# EAGLE design Natsuky (EAGLE 7.2.0)
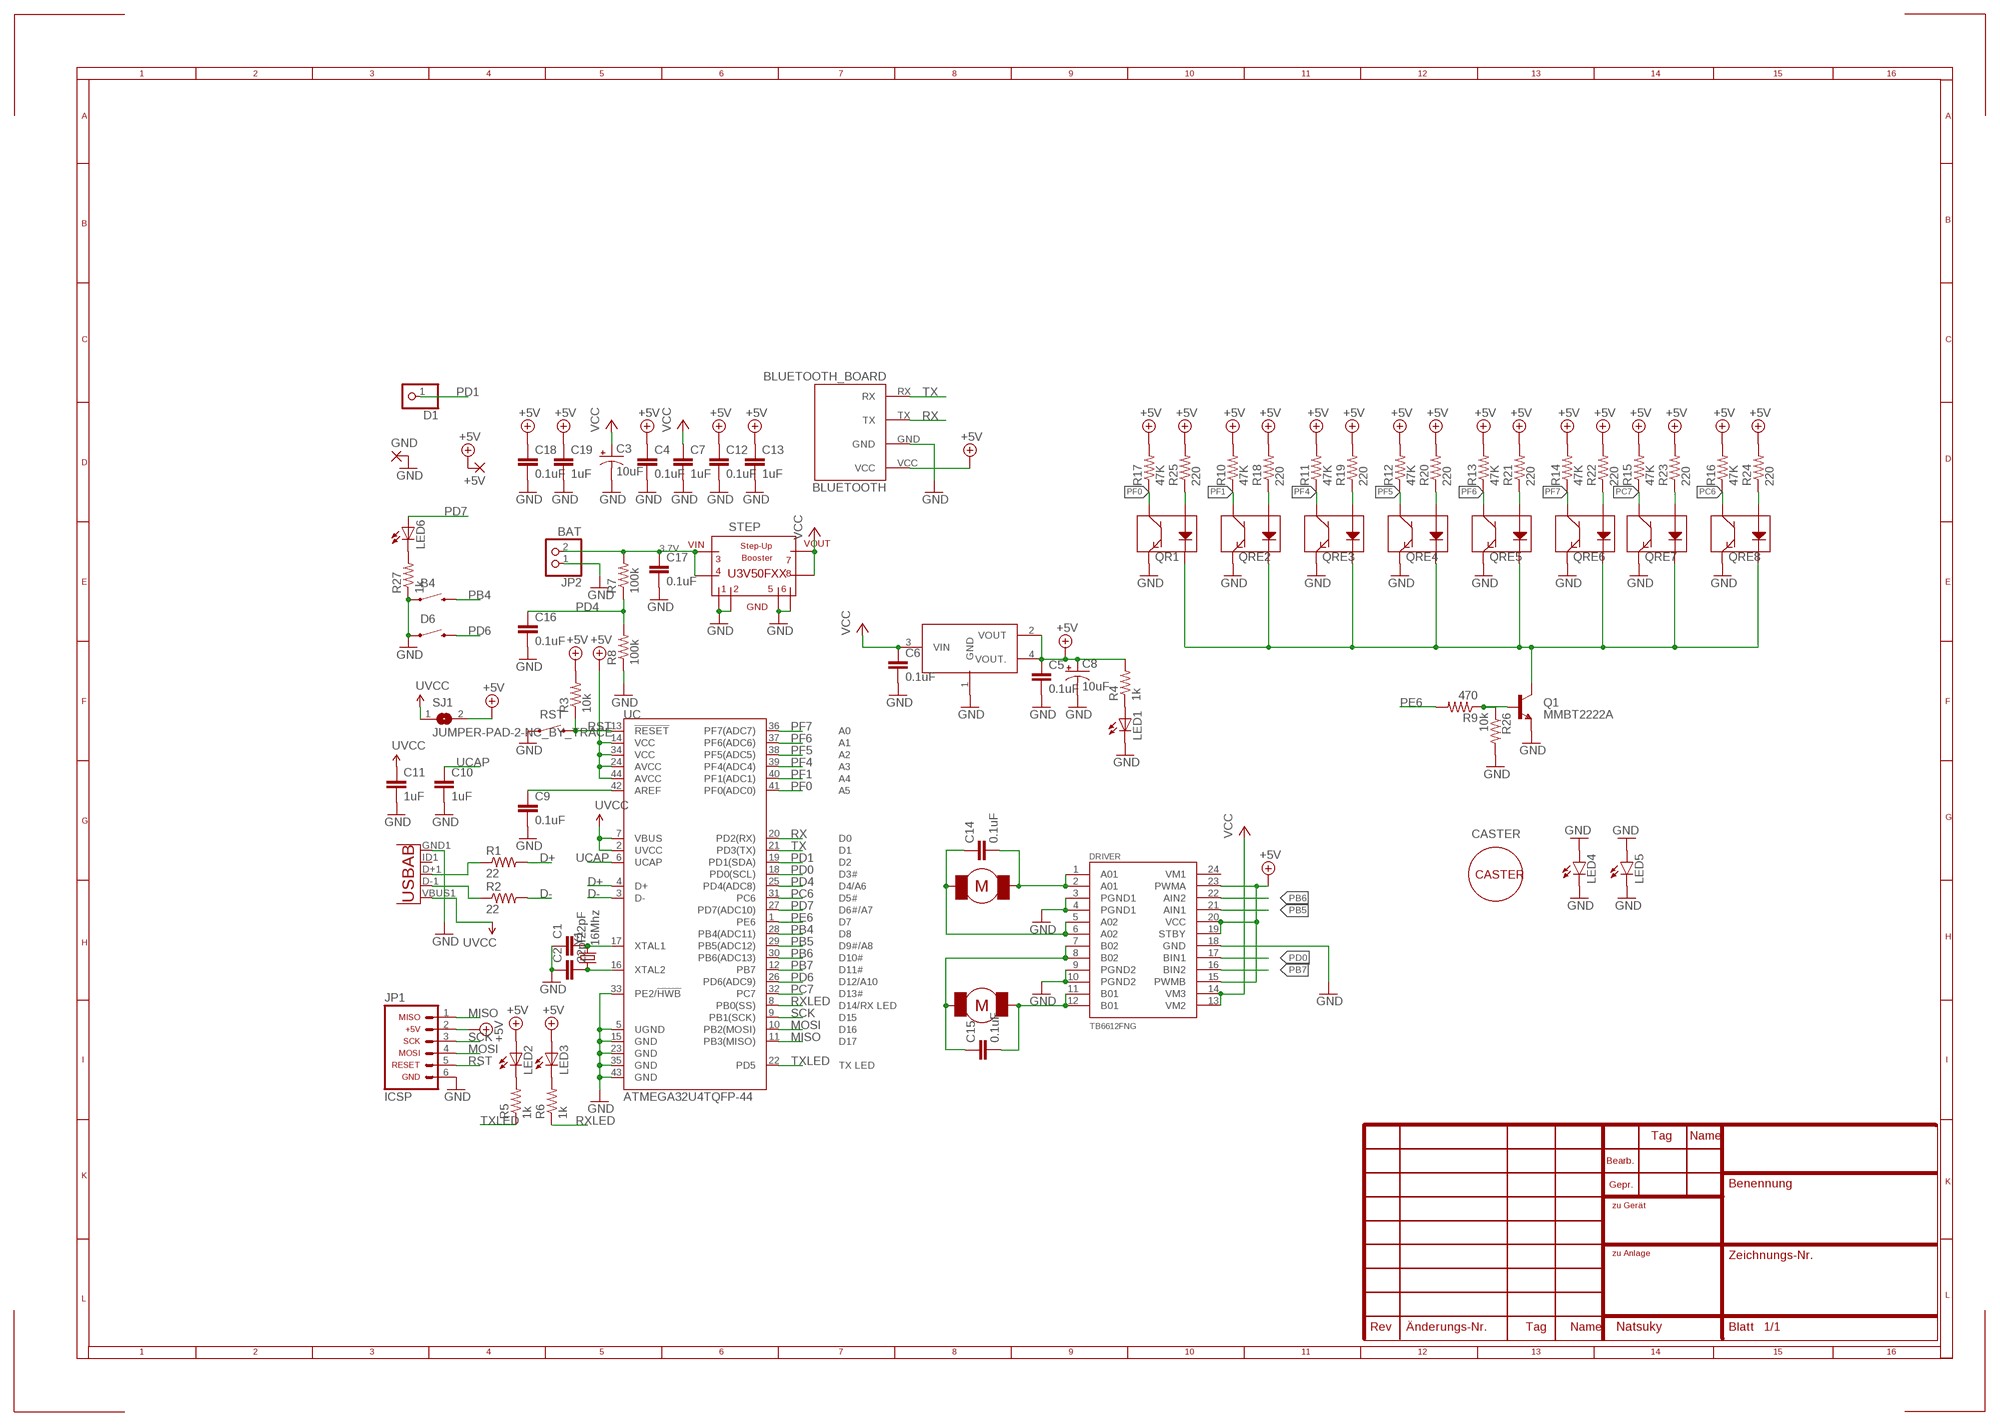
[diagram p0: schematic, sheet 1]

## Parts
+5V  SMD2  [SMD1,27-2,54]
B4  SWITCH-MOMENTARY-2SMD-1101NE  [TACTILE-SWITCH-1101NE]
BLUETOOTH  BLUETOOTH_BOARD  [BT_BOARD_FOOTPRINT]
C1  22pF  CAP0805  [0805]
C2  22pF  CAP0805  [0805]
C3  10uF  CAP_POL1206  [EIA3216]
C4  0.1uF  CAP0805  [0805]
C5  0.1uF  CAP0805  [0805]
C6  0.1uF  CAP0805  [0805]
C7  1uF  CAP0805  [0805]
C8  10uF  CAP_POLD  [PANASONIC_D]
C9  0.1uF  CAP0805  [0805]
C10  1uF  CAP0805  [0805]
C11  1uF  CAP0805  [0805]
C12  0.1uF  CAP0805  [0805]
C13  1uF  CAP0805  [0805]
C14  0.1uF  CAP0805  [0805]
C15  0.1uF  CAP0805  [0805]
C16  0.1uF  CAP0805  [0805]
C17  0.1uF  CAP0805  [0805]
C18  0.1uF  CAP0805  [0805]
C19  1uF  CAP0805  [0805]
CASTER  BALL_CASTER  [BALL_CASTER]
D1  PINHD-1X1  [1X01]
D6  SWITCH-MOMENTARY-2SMD-1101NE  [TACTILE-SWITCH-1101NE]
DRIVER  TB6612FNG  [SSOP24]
GND  SMD2  [SMD1,27-2,54]
JP1  ICSP  ARDUINO_CONN-ICSP  [CONN-2X03]
JP2  BAT  PINHD-1X2  [1X02]
LED1  LEDCHIPLED_1206  [CHIPLED_1206]
LED2  LEDCHIPLED_1206  [CHIPLED_1206]
LED3  LEDCHIPLED_1206  [CHIPLED_1206]
LED4  LED5MM  [LED5MM]
LED5  LED5MM  [LED5MM]
LED6  LEDCHIPLED_1206  [CHIPLED_1206]
M1  BRACKET_EXTENDED_WHITE  [WHITE_EXT]
M2  BRACKET_EXTENDED_WHITE  [WHITE_EXT]
Q1  MMBT2222A  TRANSISTOR_NPNMMBT2222A  [SOT23-3]
QR1  QRE1113SMD-W  [QRE1113-W]
QRE2  QRE1113SMD-W  [QRE1113-W]
QRE3  QRE1113SMD-W  [QRE1113-W]
QRE4  QRE1113SMD-W  [QRE1113-W]
QRE5  QRE1113SMD-W  [QRE1113-W]
QRE6  QRE1113SMD-W  [QRE1113-W]
QRE7  QRE1113SMD-W  [QRE1113-W]
QRE8  QRE1113SMD-W  [QRE1113-W]
R1  22  RESISTOR0805-RES  [0805]
R2  22  RESISTOR0805-RES  [0805]
R3  10k  RESISTOR0805-RES  [0805]
R4  1k  RESISTOR0805-RES  [0805]
R5  1k  RESISTOR0805-RES  [0805]
R6  1k  RESISTOR0805-RES  [0805]
R7  100k  RESISTOR0805-RES  [0805]
R8  100k  RESISTOR0805-RES  [0805]
R9  470  RESISTOR0805-RES  [0805]
R10  47K  RESISTOR0805-RES  [0805]
R11  47K  RESISTOR0805-RES  [0805]
R12  47K  RESISTOR0805-RES  [0805]
R13  47K  RESISTOR0805-RES  [0805]
R14  47K  RESISTOR0805-RES  [0805]
R15  47K  RESISTOR0805-RES  [0805]
R16  47K  RESISTOR0805-RES  [0805]
R17  47K  RESISTOR0805-RES  [0805]
R18  220  RESISTOR0805-RES  [0805]
R19  220  RESISTOR0805-RES  [0805]
R20  220  RESISTOR0805-RES  [0805]
R21  220  RESISTOR0805-RES  [0805]
R22  220  RESISTOR0805-RES  [0805]
R23  220  RESISTOR0805-RES  [0805]
R24  220  RESISTOR0805-RES  [0805]
R25  220  RESISTOR0805-RES  [0805]
R26  10k  RESISTOR0805-RES  [0805]
R27  1k  RESISTOR0805-RES  [0805]
REG  LD1117S50TR  [SOT223]
RST  SWITCH-MOMENTARY-2SMD-1101NE  [TACTILE-SWITCH-1101NE]
SJ1  JUMPER-PAD-2-NC_BY_TRACE  SJ  [SJ]
STEP  STEP-UP  [U3V50F12]
UC  ATMEGA32U4TQFP-44  [TQFP44]
X1  usb  USB-ABIN&OUT  [USB-AB-MICRO-SMD-V03-IN&OUT]
Y1  16Mhz  CRYSTALHC49US  [HC49US]

## Nets
3.3V: C11.1 SJ1.1 UC.2(UVCC) UC.7(VBUS) X1.VBUS1(VBUS) ; supply symbol labelled UVCC
3.7V: C17.1 JP2.2 R7.2 STEP.VIN STEP.VIN_4(VIN4)
+5V: +5V.1(P) BLUETOOTH.VCC C4.1 C5.1 C8.+ C12.1 C13.1 C18.1 C19.1 DRIVER.15(PWMB) DRIVER.19(STBY) DRIVER.20(VCC) DRIVER.23(PWMA) JP1.2 LED2.A LED3.A R3.2 R4.2 R10.2 R11.2 R12.2 R13.2 R14.2 R15.2 R16.2 R17.2 R18.2 R19.2 R20.2 R21.2 R22.2 R23.2 R24.2 R25.2 REG.2(VOUT) REG.4(VOUT.) SJ1.2 UC.14(VCC) UC.24(AVCC) UC.34(VCC) UC.44(AVCC)
COLECTOR_EMISORES: Q1.3(C) QR1.2(K) QRE2.2(K) QRE3.2(K) QRE4.2(K) QRE5.2(K) QRE6.2(K) QRE7.2(K) QRE8.2(K)
D+: R1.2 UC.4(D+)
D-: R2.2 UC.3(D-)
GND: B4.1 BLUETOOTH.GND C1.1 C2.1 C3.C(-) C4.2 C5.2 C6.2 C7.2 C8.- C9.2 C10.2 C11.2 C12.2 C13.2 C16.2 C17.2 C18.2 C19.2 D6.1 DRIVER.3(PGND1) DRIVER.4(PGND1) DRIVER.9(PGND2) DRIVER.10(PGND2) DRIVER.18(GND) GND.1(P) JP1.6 JP2.1 LED1.C LED4.A LED4.K(C) LED5.A LED5.K(C) Q1.2(E) QR1.4(E) QRE2.4(E) QRE3.4(E) QRE4.4(E) QRE5.4(E) QRE6.4(E) QRE7.4(E) QRE8.4(E) R8.1 R26.2 R27.1 REG.1(GND) RST.1 STEP.GND_OUT(GND_VOUT) STEP.GND_OUT_1(GND_OUT1) STEP.GND_VIN STEP.GND_VIN_1(GND_VIN1) UC.5(UGND) UC.15(GND) UC.23(GND) UC.33(PE2/!HWB) UC.35(GND) UC.43(GND) X1.GND1(GND)
M1: C14.2 DRIVER.1(A01) DRIVER.2(A01) M2.M1
M2: C14.1 DRIVER.5(A02) DRIVER.6(A02) M2.M2
M3: C15.1 DRIVER.7(B02) DRIVER.8(B02) M1.M1
M4: C15.2 DRIVER.11(B01) DRIVER.12(B01) M1.M2
MISO: JP1.1 UC.11(PB3(MISO))
MOSI: JP1.4 UC.10(PB2(MOSI))
N$1: C1.2 UC.17(XTAL1) Y1.2
N$2: C2.2 UC.16(XTAL2) Y1.1
N$3: Q1.1(B) R9.1 R26.1
N$4: LED1.A R4.1
N$5: LED2.C R5.2
N$6: LED3.C R6.2
N$7: R2.1 X1.D-1(D-)
N$8: R1.1 X1.D+1(D+)
N$9: C9.1 UC.42(AREF)
N$10: LED6.C R27.2
N$17: QRE2.1(A) R18.1
N$18: QRE3.1(A) R19.1
N$19: QRE4.1(A) R20.1
N$20: QRE5.1(A) R21.1
N$21: QRE6.1(A) R22.1
N$22: QRE7.1(A) R23.1
N$23: QRE8.1(A) R24.1
N$24: QR1.1(A) R25.1
PB4: B4.2 UC.28(PB4(ADC11))
PB5: DRIVER.21(AIN1) UC.29(PB5(ADC12))
PB6: DRIVER.22(AIN2) UC.30(PB6(ADC13))
PB7: DRIVER.16(BIN2) UC.12(PB7)
PC6: QRE8.3(C) R16.1 UC.31(PC6)
PC7: QRE7.3(C) R15.1 UC.32(PC7)
PD0: DRIVER.17(BIN1) UC.18(PD0(SCL))
PD1: D1.1 UC.19(PD1(SDA))
PD4: C16.1 R7.1 R8.2 UC.25(PD4(ADC8))
PD6: D6.2 UC.26(PD6(ADC9))
PD7: LED6.A UC.27(PD7(ADC10))
PE6: R9.2 UC.1(PE6)
PF0: QR1.3(C) R17.1 UC.41(PF0(ADC0))
PF1: QRE2.3(C) R10.1 UC.40(PF1(ADC1))
PF4: QRE3.3(C) R11.1 UC.39(PF4(ADC4))
PF5: QRE4.3(C) R12.1 UC.38(PF5(ADC5))
PF6: QRE5.3(C) R13.1 UC.37(PF6(ADC6))
PF7: QRE6.3(C) R14.1 UC.36(PF7(ADC7))
RST: JP1.5 R3.1 RST.2 UC.13(!RESET)
RX: BLUETOOTH.TX UC.20(PD2(RX))
RXLED: R6.1 UC.8(PB0(SS))
SCK: JP1.3 UC.9(PB1(SCK))
TX: BLUETOOTH.RX UC.21(PD3(TX))
TXLED: R5.1 UC.22(PD5)
UCAP: C10.1 UC.6(UCAP)
VCC: C3.A(+) C6.1 C7.1 DRIVER.13(VM2) DRIVER.14(VM3) REG.3(VIN) STEP.VOUT STEP.VOUT_4(VOUT4)
Unconnected: DRIVER.24(VM1) X1.ID1(USBID)

## Library data of the parts
+5V GND = wirepad:SMD2: SMD PAD
B4 D6 RST = SparkFun-Electromechanical:SWITCH-MOMENTARY-2: Various NO switches- pushbuttons, reed, etc; PROD_ID: SWCH-00815
BLUETOOTH = HC-05:BLUETOOTH_BOARD: Bluetooth Board V1.05
C1 C2 = SparkFun-Capacitors:CAP: Capacitor Standard 0603 ceramic capacitor, and 0.1" leaded capacitor.
C3 C8 = SparkFun-Passives:CAP_POL: Capacitor Polarized These are standard SMD and PTH capacitors. Normally 10uF, 47uF, and 100uF in electrolytic and tantalum varieties. Always verify the external diameter of the through hole cap, it varies with capacity, voltage, and manufacturer. The EIA devices should be standard.
C4-C7 C9-C19 = SparkFun-Passives:CAP: Capacitor Standard 0603 ceramic capacitor, and 0.1" leaded capacitor.
CASTER = bracket_motor:BALL_CASTER
D1 = pinhead:PINHD-1X1: PIN HEADER
DRIVER = SparkFun-PowerIC:TB6612FNG: Toshiba 1A dual motor driver IC-09363; PROD_ID: IC-09363
JP1 = arduino_jw:ARDUINO_CONN-ICSP: Arduino ICSP I/O Header This is the ICSP I/O header on the Arduino Uno R3. This connector is labeled with the following pin assignments: MISO +5V SCK MOSI RESET GND NOTE: Be sure you install this connector with the correct orientation on your PCB layout. Pin 1 has a square pad to assist with orientation.
JP2 = pinhead:PINHD-1X2: PIN HEADER
LED1-LED3 LED6 = adafruit:LED: LED OSRAM: - CHIPLED LG R971, LG N971, LY N971, LG Q971, LY Q971, LO R971, LY R971 LH N974, LH R974 LS Q976, LO Q976, LY Q976 LO Q996 - Hyper CHIPLED LW Q18S LB Q993, LB Q99A, LB R99A - SideLED LS A670, LO A670, LY A670, LG A670, LP A670 LB A673, LV A673, LT A673, LW A673 LH A674 LY A675 LS A676, LA A676, LO A676, LY A676, LW A676 LS A679, LY A679, LG A679 - Hyper Micro SIDELED® LS Y876, LA Y876, LO Y876, LY Y876 LT Y87S - SmartLED LW L88C, LW L88S LB L89C, LB L89S, LG L890 LS L89K, LO L89K, LY L89K LS L896, LA L896, LO L896, LY L896 - TOPLED LS T670, LO T670, LY T670, LG T670, LP T670 LSG T670, LSP T670, LSY T670, LOP T670, LYG T670 LG T671, LOG T671, LSG T671 LB T673, LV T673, LT T673, LW T673 LH T674 LS T676, LA T676, LO T676, LY T676, LB T676, LH T676, LSB T676, LW T676 LB T67C, LV T67C, LT T67C, LS T67K, LO T67K, LY T67K, LW E67C LS E67B, LA E67B, LO E67B, LY E67B, LB E67C, LV E67C, LT E67C LW T67C LS T679, LY T679, LG T679 LS T770, LO T770, LY T770, LG T770, LP T770 LB T773, LV T773, LT T773, LW T773 LH T774 LS E675, LA E675, LY E675, LS T675 LS T776, LA T776, LO T776, LY T776, LB T776 LHGB T686 LT T68C, LB T68C - Hyper Mini TOPLED® LB M676 - Mini TOPLED Santana® LG M470 LS M47K, LO M47K, LY M47K Source: http://www.osram.convergy.de/
LED4 LED5 = SparkFun-LED:LED: LEDs Standard schematic elements and footprints for 5mm, 3mm, 1206, and 0603 sized LEDs. 5mm - Spark Fun Electronics SKU : COM-00529 (and others)
M1 M2 = bracket_motor:BRACKET_EXTENDED_WHITE
Q1 = SparkFun-DiscreteSemi:TRANSISTOR_NPN: Generic NPN BJT MMBT2222A - TRANS-08049 (SOT-23, 1A 40V) MPSA42 - TRANS-09116 (SOT-23, 500mA 300V) MMBT5088LT1G - TRANS-11160 (SOT-23, 50 mA 30V) BC547 - COM-08928 <http://www.sparkfun.com/products/8928> (TO-92 45V 100mA) (1.Collector 2.Base 3.Emitter) 2N3904 - COM-00521 <http://www.sparkfun.com/products/521> (TO-92 40V 200mA) (1.Emitter 2.Base 3.Collector) P2N2222A - COM-12852 <http://www.sparkfun.com/products/12852> (TO-92 40V 600mA) (1.Collector 2.Base 3.Emitter); PROD_ID: TRANS-08049
QR1 QRE2-QRE8 = SparkFun-Sensors:QRE1113: Reflective object sensor
R1-R27 = SparkFun-Resistors:RESISTOR: Resistor Basic schematic elements and footprints for 0603, 1206, and PTH resistors.
REG = v-reg:LD1117S50TR
SJ1 = jumper:SJ: SMD solder JUMPER
STEP = step-up-Pololu:STEP-UP
UC = SparkFun-DigitalIC:ATMEGA32U4: Atmel 44-pin 8-bit Microcontroller with 32KBytes of ISP Flash and USB Controller
X1 = Testing:USB-AB: This is a USB AB connector that is compatible with USB OTG. i.e. this connector can serve as a host or device
Y1 = SparkFun-FreqCtrl:CRYSTAL: Various standard crystals. Proven footprints.

## Board
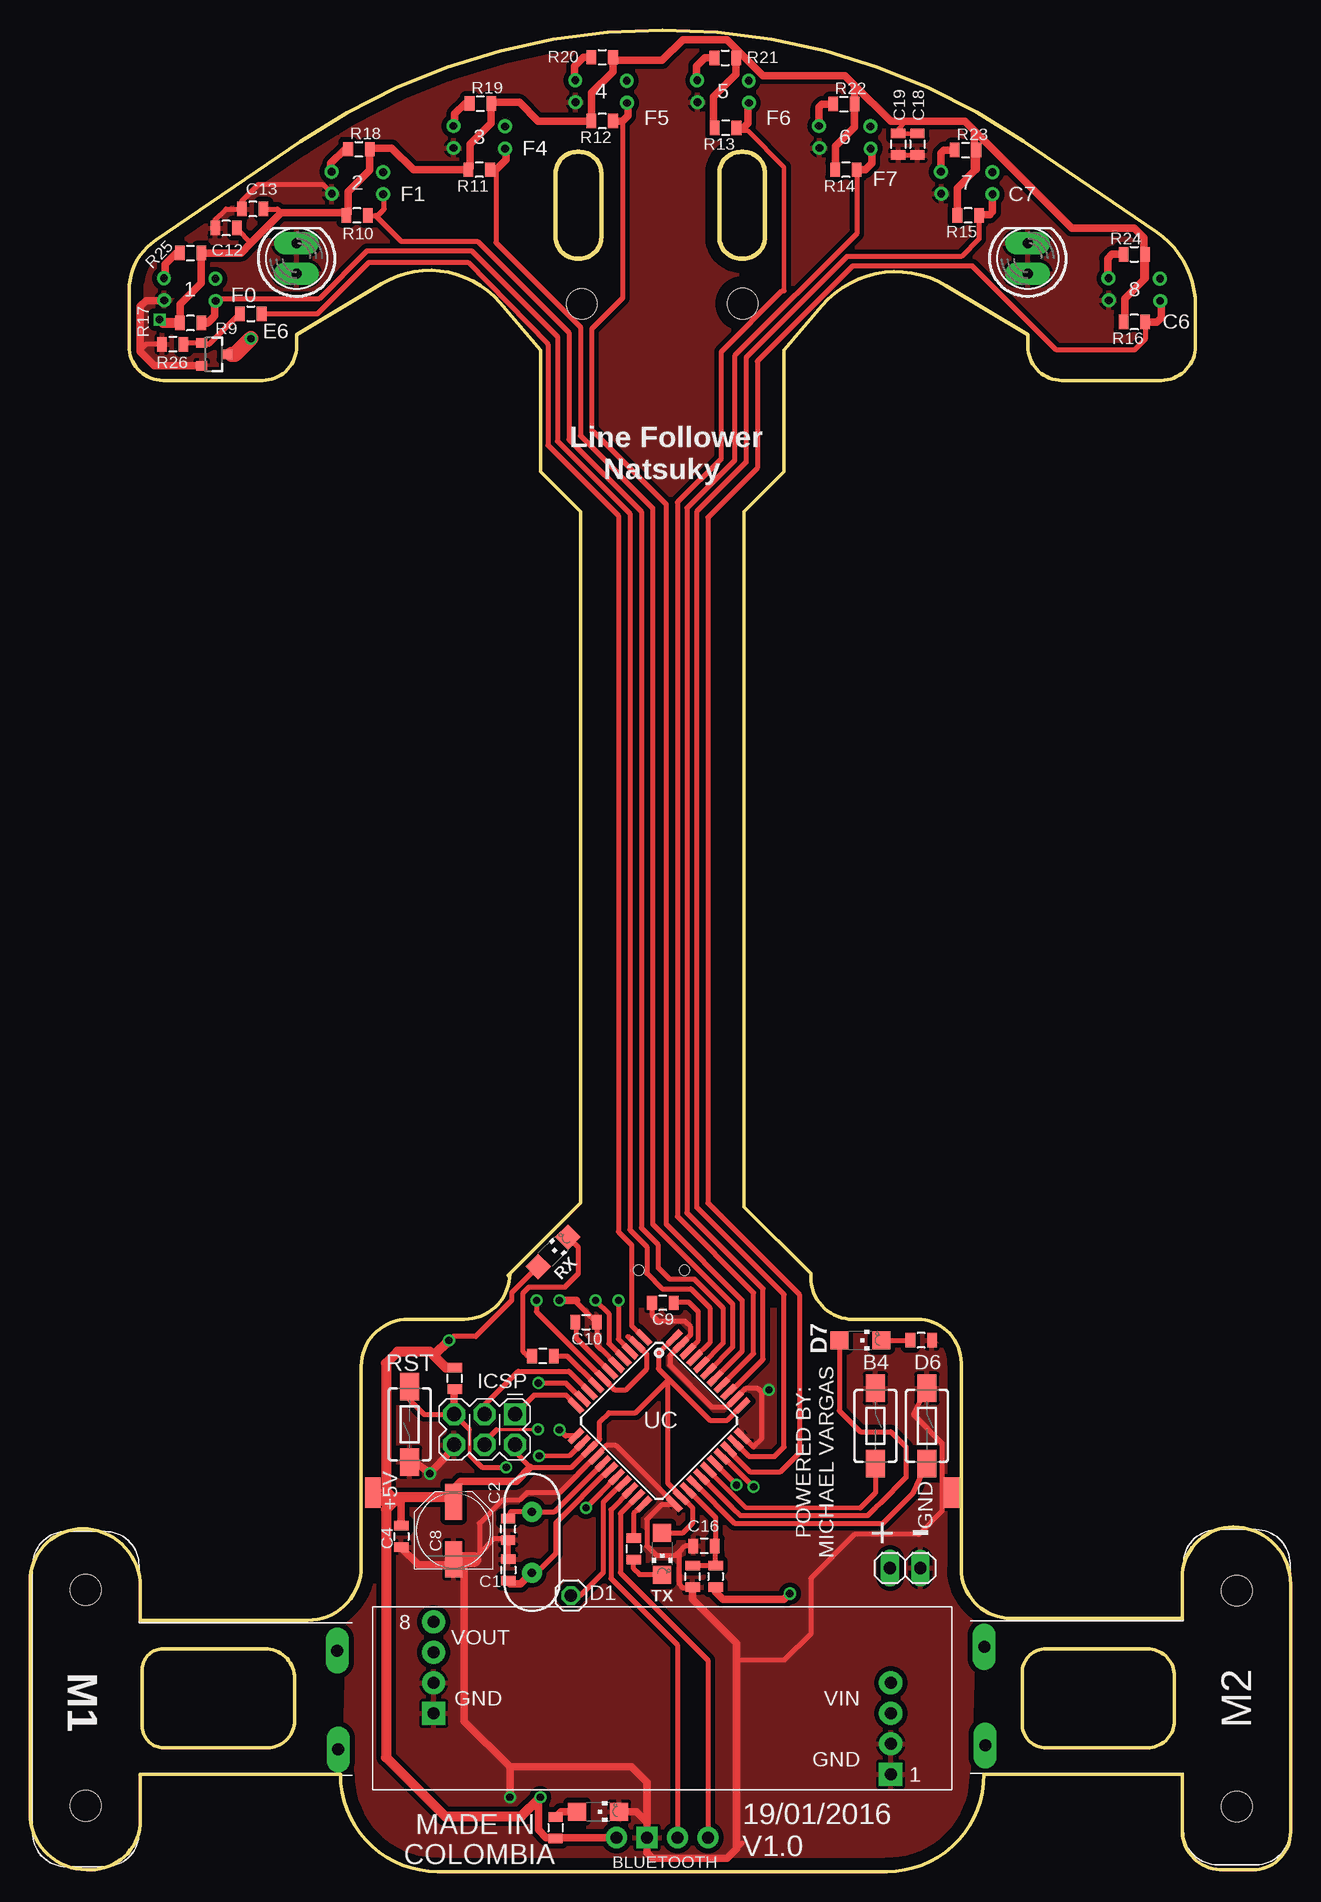
[diagram p1: board, top side]
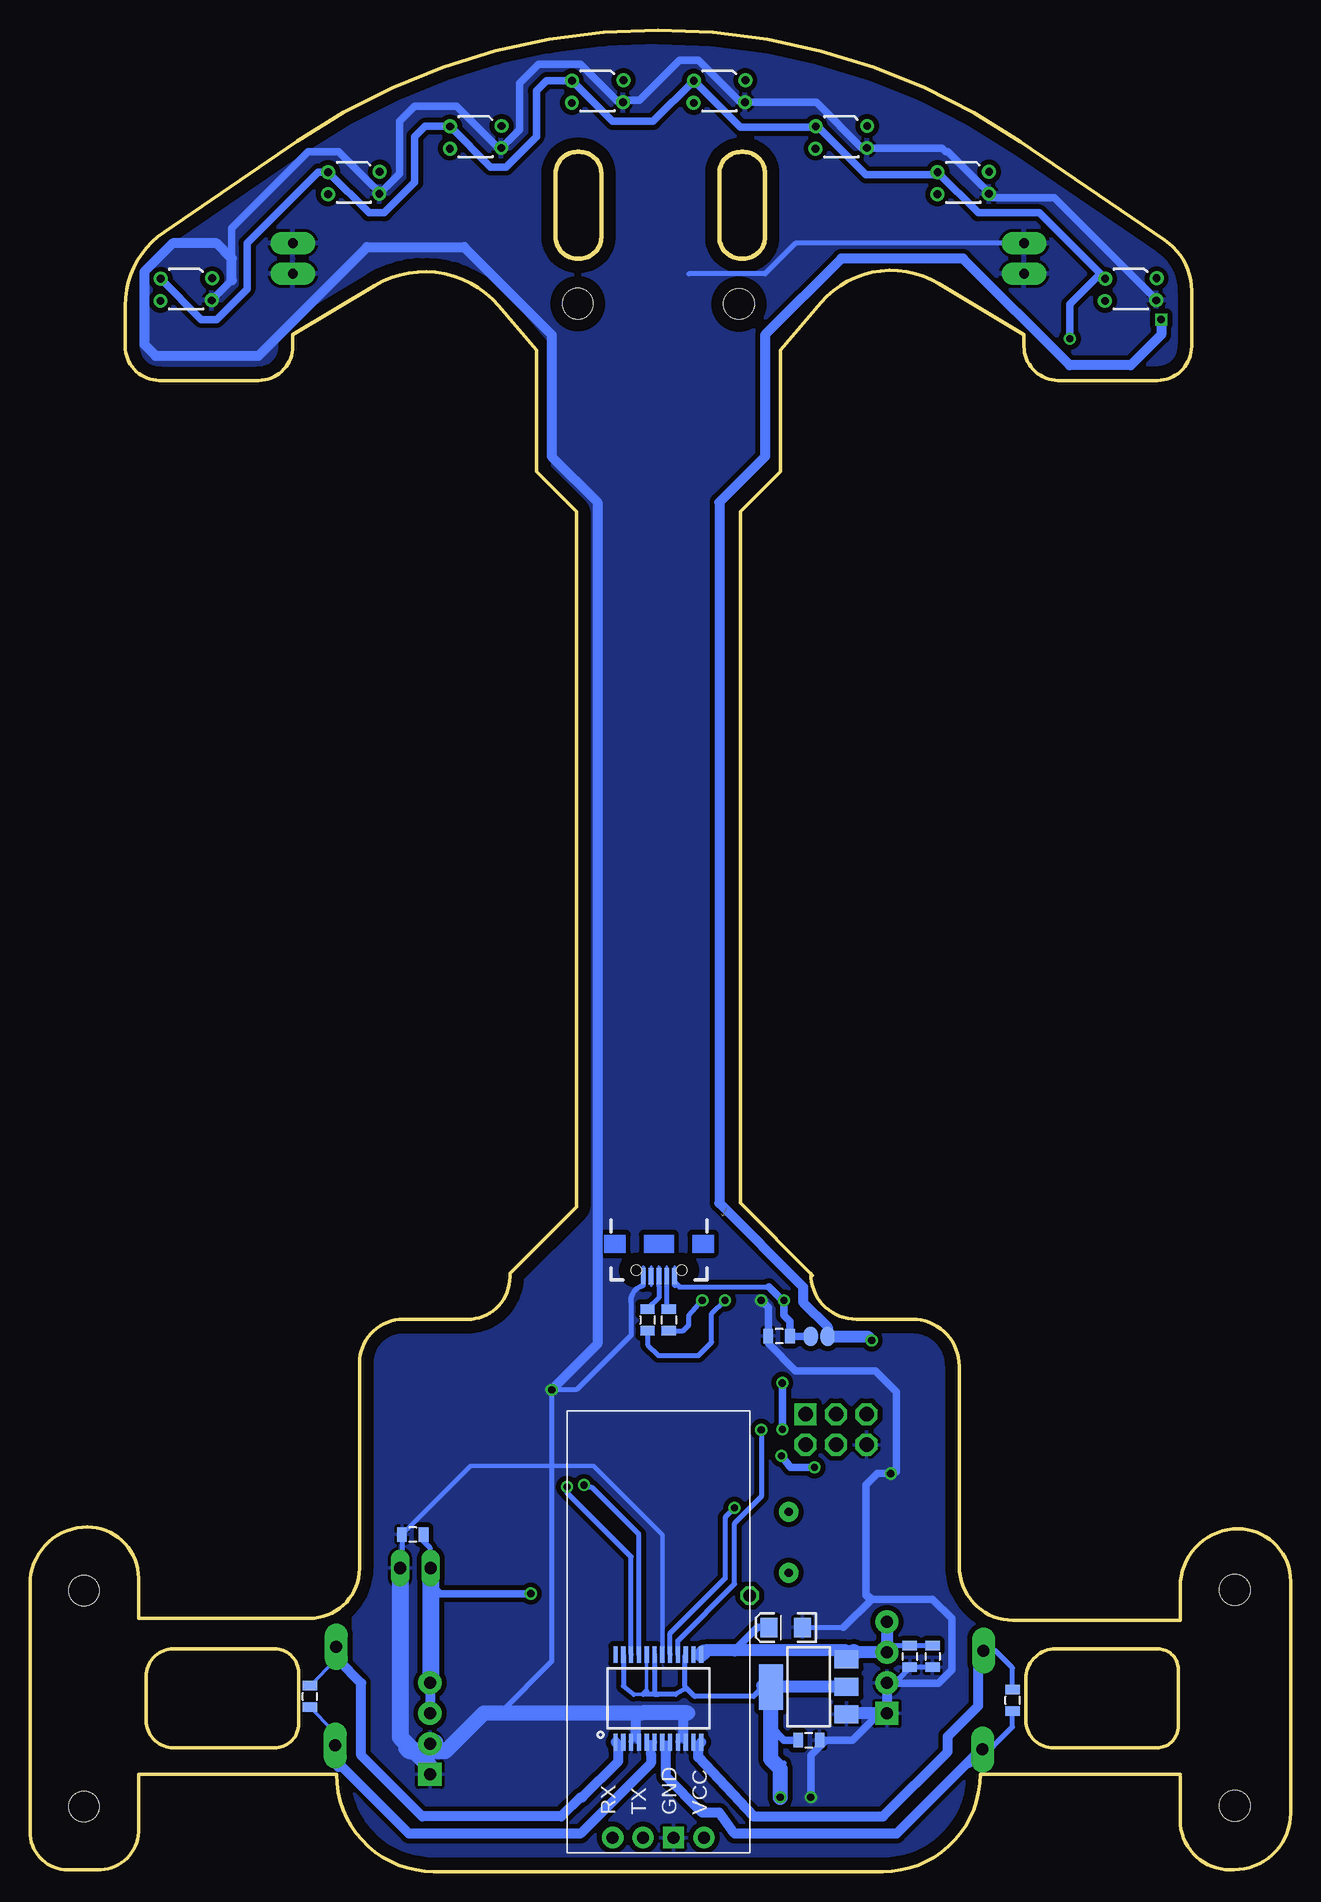
[diagram p2: board, bottom side, seen from below]

Size 105.09 x 153.51 mm. Coordinates in mm from the lower left corner, seen from the top.
Outline: 9.21,7.94 9.21,4.3 arc-90 5.07,0.16 4.72,0.16 arc-90 0,4.88 0,24.2 arc-90 4.38,28.58 arc-90 9.21,23.75 9.21,20.96 23.14,20.96 arc90 27.62,25.44 27.62,42.13 arc-90 31.53,46.04 36.19,46.04 arc90 40,49.85
Outline: 9.21,8.1 25.88,8.1 arc90 33.97,0 71.44,0 arc90 79.53,8.1 96.04,8.1 96.04,3.62 arc90 99.19,0.16 101.94,0.16 arc90 105.09,3.31 105.09,23.96 arc90 100.32,28.73 arc90 96.04,24.46 96.04,21.11 81.78,21.11 arc-90 77.63,25.27 77.63,42.38 arc90 73.97,46.04 68.61,46.04 arc-90 65.09,49.56 65.09,49.85 59.53,55.4 59.53,113.35 62.86,116.68 62.86,126.84 66.02,130.52 arc-80 76.37,132.2 83.19,128.11 83.19,127.14 arc90 86.03,124.3 94.31,124.3 arc90 97.16,127.14 97.16,130.55 arc56 93.92,136.67 82.83,144.23 arc34 52.74,153.51 arc34 22.53,144.19 10.47,135.97 arc56 8.25,131.78 8.25,127.14 arc90 11.09,124.3 19.38,124.3 arc90 22.22,127.14 22.22,128.11 29.33,132.37 arc-80 39.17,130.78 42.55,126.84 42.55,116.68 45.88,113.35 45.88,55.72 39.85,49.69
Outline: 9.37,12.12 9.37,16.86 arc-90 11.08,18.57 19.58,18.57 arc-90 22.07,16.09 22.07,12.59 arc-90 19.79,10.32 11.16,10.32 arc-90 9.37,12.12
Outline: 95.41,16.3 95.41,12.59 arc-90 93.14,10.32 84.7,10.32 arc-90 82.71,12.31 82.71,16.58 arc-90 84.7,18.57 93.14,18.57 arc-90 95.41,16.3
Outline: 45.61,134.46 45.83,134.46 arc90 47.62,136.26 47.62,141.56 arc90 45.83,143.35 45.61,143.35 arc90 43.81,141.56 43.81,136.26 arc90 45.61,134.46
Outline: 59.26,134.46 59.48,134.46 arc90 61.28,136.26 61.28,141.56 arc90 59.48,143.35 59.26,143.35 arc90 57.47,141.56 57.47,136.26 arc90 59.26,134.46
Copper layers (1*16): Top 0.035mm / dielectric 1.5mm / Bottom 0.035mm
Design rules "default": minimum track width 10mil, minimum drill 24mil, track to track 8mil, track to pad 8mil, pad to pad 8mil, via to via 8mil, smd to smd 8mil, copper to edge 40mil, drill to drill 8mil, minimum pad ring 10mil, minimum via ring 8mil, stop-mask expansion 4mil, vias tented up to drill 0mil, thermal gap 10mil

### Footprints (pad centres in the part's own frame; a part is rotated, then mirrored left to right if it is on the bottom)
SMD1,27-2,54 = smd 1.27 x 2.54: 1 0,0
TACTILE-SWITCH-1101NE = smd 2.3 x 1.6: 1 -3.15,0; 2 3.15,0
BT_BOARD_FOOTPRINT = drill 1 pad 1.778 square: GND -16.51,-1.27 | drill 1 pad 1.778: RX -16.51,3.81; TX -16.51,1.27; VCC -16.51,-3.81
0805 = smd 0.8 x 1.2: 1 -0.9,0; 2 0.9,0
EIA3216 = smd 1.4 x 1.6: A 1.4,0; C -1.4,0
PANASONIC_D = smd 3 x 1.4: + 2.4,0; - -2.4,0
BALL_CASTER = hole 2.546: -6.708,0.023; 6.719,0.046
1X01 = drill 1.016 octagon: 1 0,0
SSOP24 = smd 0.348 x 1.397: 1 -3.575,-3.656; 2 -2.925,-3.656; 3 -2.275,-3.656; 4 -1.625,-3.656; 5 -0.975,-3.656; 6 -0.325,-3.656; 7 0.325,-3.656; 8 0.975,-3.656; 9 1.625,-3.656; 10 2.275,-3.656; 11 2.925,-3.656; 12 3.575,-3.656; 13 3.575,3.656; 14 2.925,3.656; 15 2.275,3.656; 16 1.625,3.656; 17 0.975,3.656; 18 0.325,3.656; 19 -0.325,3.656; 20 -0.975,3.656; 21 -1.625,3.656; 22 -2.275,3.656; 23 -2.925,3.656; 24 -3.575,3.656
CONN-2X03 = drill 1.2 pad 1.829 square: 1 0,0 | drill 1.2 pad 1.829 octagon: 2 2.54,0; 3 0,-2.54; 4 2.54,-2.54; 5 0,-5.08; 6 2.54,-5.08
1X02 = drill 1.016 long: 1 -1.27,0; 2 1.27,0
CHIPLED_1206 = smd 1.5 x 1.5: A 0,-1.75; C 0,1.75
LED5MM = drill 0.813 pad 1.88 long: A -1.27,0; K 1.27,0
WHITE_EXT = drill 1 pad 1.93 long: M1 -4.199,-0.09; M2 4.031,-0.007 | hole 2.546: -8.89,20.955; 9.11,20.955
SOT23-3 = smd 0.8 x 0.9: 1 -0.95,-1; 2 0.95,-1; 3 0,1.1
QRE1113-W = drill 0.65: 1 -2.166,-0.892; 2 2.127,-0.853; 3 2.14,0.995; 4 -2.14,0.944
SOT223 = smd 1.5 x 2: 1 -2.3,-3.15; 2 0,-3.15; 3 2.3,-3.15 | smd 3.8 x 2: 4 0,3.15
SJ = smd 1.168 x 1.6: 1 -0.635,0; 2 0.762,0
U3V50F12 = drill 1 pad 1.93: GND_OUT 19.05,-1.27; GND_VIN -19.05,3.81; VIN -19.05,1.27; VIN_4 -19.05,-1.27; VOUT 19.05,-3.81; VOUT_4 19.05,-6.35 | drill 1 pad 1.93 square: GND_OUT_1 19.05,1.27; GND_VIN_1 -19.05,6.35
TQFP44 = smd 1.5 x 0.5: 1 -5.8,4; 2 -5.8,3.2; 3 -5.8,2.4; 4 -5.8,1.6; 5 -5.8,0.8; 6 -5.8,0; 7 -5.8,-0.8; 8 -5.8,-1.6; 9 -5.8,-2.4; 10 -5.8,-3.2; 11 -5.8,-4; 23 5.8,-4; 24 5.8,-3.2; 25 5.8,-2.4; 26 5.8,-1.6; 27 5.8,-0.8; 28 5.8,0; 29 5.8,0.8; 30 5.8,1.6; 31 5.8,2.4; 32 5.8,3.2; 33 5.8,4 | smd 0.5 x 1.5: 12 -4,-5.8; 13 -3.2,-5.8; 14 -2.4,-5.8; 15 -1.6,-5.8; 16 -0.8,-5.8; 17 0,-5.8; 18 0.8,-5.8; 19 1.6,-5.8; 20 2.4,-5.8; 21 3.2,-5.8; 22 4,-5.8; 34 4,5.8; 35 3.2,5.8; 36 2.4,5.8; 37 1.6,5.8; 38 0.8,5.8; 39 0,5.8; 40 -0.8,5.8; 41 -1.6,5.8; 42 -2.4,5.8; 43 -3.2,5.8; 44 -4,5.8
USB-AB-MICRO-SMD-V03-IN&OUT = smd 1.4 x 0.4: D+1 2.7,0; D-1 2.7,0.65; GND1 2.7,-1.3; ID1 2.7,-0.65; VBUS1 2.7,1.3 | hole 0.85: 2.2,1.9; 2.2,-1.9
HC49US = drill 0.7 pad 1.651: 1 -2.54,0; 2 2.54,0

### Placement (x,y rotation side)
+5V  28.57,31.59 0 top
B4  70.48,37.15 270 top
BLUETOOTH  52.71,19.35 90 bottom
C1  39.87,25.15 270 top
C2  39.85,28.54 90 top
C3  42.09,20.35 180 bottom
C4  30.96,27.94 270 top
C5  40.16,10.95 0 bottom
C6  31.75,17.94 270 bottom
C7  29.84,17.94 270 bottom
C8  35.3,28.43 90 top
C9  52.75,47.41 180 top
C10  46.35,45.8 0 top
C11  42.64,44.64 180 bottom
C12  16.35,137 180 top
C13  18.57,138.59 180 top
C14  81.76,14.61 90 bottom
C15  23.18,14.29 90 bottom
C16  56.2,27.15 180 top
C17  73.18,28.1 180 bottom
C18  73.98,143.99 270 top
C19  72.39,143.99 270 top
CASTER  52.7,130.65 0 top
D1  45.09,23.02 0 top
D6  74.77,37.15 270 top
DRIVER  52.7,14.45 0 bottom
GND  76.83,31.59 0 top
JP1  40.44,38.13 270 top
JP2  72.96,25.3 180 top
LED1  47.35,5 270 top
LED2  52.7,26.51 180 top
LED3  43.61,51.67 315 top
LED4  22.22,134.46 90 top
LED5  83.19,134.46 90 top
LED6  69.22,44.29 270 top
M1  25.6,14.38 90 top
M2  79.65,14.54 270 top
Q1  15.31,126.47 270 top
QR1  13.34,131.92 180 bottom
QRE2  27.3,140.81 180 bottom
QRE3  37.46,144.62 180 bottom
QRE4  47.62,148.43 180 bottom
QRE5  57.78,148.43 180 bottom
QRE6  67.94,144.62 180 bottom
QRE7  78.1,140.81 180 bottom
QRE8  92.07,131.92 180 bottom
R1  53.61,45.99 270 bottom
R2  51.83,45.99 270 bottom
R3  35.4,41.12 90 top
R4  43.81,3.65 270 top
R5  50.33,26.91 270 top
R6  42.75,42.97 180 top
R7  57.15,24.61 270 top
R8  55.24,24.61 90 top
R9  18.41,129.86 0 top
R10  27.26,138.05 180 top
R11  37.45,141.86 180 top
R12  47.7,145.92 180 top
R13  57.99,145.36 180 top
R14  68.03,141.86 180 top
R15  78.22,138.05 180 top
R16  92.06,129.16 180 top
R17  13.39,129.08 180 top
R18  27.42,143.57 0 top
R19  37.55,147.38 0 top
R20  47.7,151.24 0 top
R21  57.96,151.19 0 top
R22  67.85,147.33 0 top
R23  78,143.5 0 top
R24  92.06,134.81 0 top
R25  13.39,134.92 0 top
R26  11.91,127.32 180 top
R27  74.3,44.29 180 top
REG  40.16,15.4 90 bottom
RST  31.65,37.29 90 top
SJ1  39.37,44.61 0 bottom
STEP  52.7,14.46 180 top
UC  52.44,37.58 315 top
X1  52.66,52.34 270 bottom
Y1  41.84,27.45 270 top

### Tracks (layer width: path | path; a pad name or v marks a point on that pad's centre or on a via)
3.3V  (via drill 0.6)
  Top 0.406: v42.23,47.63 42.23,46.67 UC.7 48.74,40.16 49.69,40.16 51.43,41.91 51.43,43.12 UC.2 50.6,44.01 50.45,44.01 49.85,44.61
  Bottom 0.406: 51.36,48.84 51.36,49.14 | 51.36,49.76 51.36,49.14 | 51.36,49.14 50.96,48.74 43.5,48.74 43.49,48.74
  Bottom 0.61: SJ1.1 41.71,44.61 C11.1 41.75,44.65 41.75,45.88 42.23,46.36 v42.23,47.63 42.37,47.63 43.49,48.74
3.7V  (via drill 0.6)
  Top 0.406: R7.2 57.15,23.65
  Top 0.61: 57.15,23.65 57.15,23.34 57.78,22.7 62.86,22.7 v63.34,23.18
  Bottom 0.406: C17.1 72.28,27.52 71.75,26.99 71.75,25.37 JP2.2
  Bottom 0.61: v63.34,23.18 70.9,23.18 71.69,23.97
  Bottom 0.813: STEP.VIN_4 STEP.VIN
  Bottom 1.422: JP2.2 71.69,23.97 71.69,15.8 STEP.VIN_4
+5V  (via drill 0.6)
  Top 0.356: C18.1 C19.1 72.39,145.26 73.03,145.89
  Top 0.406: JP1.2 40.44,34.97 41.7,33.7 45.16,33.7 UC.14 47.5,36.04 47.5,37.5 48.26,38.26 50.48,38.26 53.1,40.88 | UC.44 52.39,43.18 52.39,41.91 53.26,41.04 | UC.34 58.14,37.62 56.67,37.62 53.26,41.04 | 53.1,40.88 53.26,41.04 | 53.1,40.88 53.18,40.8 53.18,32.39 54.28,31.29 UC.24 54.35,31.22 55.24,30.32 55.24,29.05 54.45,28.26 LED2.A | 12.37,129.2 R17.2 | C12.1 17.25,136.9 18.41,135.73 | C13.1 20.64,138.59 20.95,138.27 | LED3.A 42.02,50.11 40.16,48.26 40.16,47.63 37.15,44.61 35.24,44.61 v34.92,44.29
  Top 0.61: 40.7,35.32 JP1.2 | BLUETOOTH.VCC 43.91,2.84 | 43.91,2.84 R4.2 | 43.91,2.84 43.04,2.84 42.39,3.49 42.39,6.03 v42.55,6.19 | 41.7,33.7 40.55,32.54 35.88,32.54 34.92,31.59 34.92,31.21 C8.+ 35.18,30.96 | R17.2 12.54,129.13 12.54,130.65 14.29,132.4 R25.2 17.6,134.92 18.41,135.73 20.95,138.27 26.14,138.27 R10.2 26.51,138.2 26.51,140.02 28.32,141.82 R18.2 28.42,143.67 30.16,143.67 31.97,141.86 R11.2 36.67,141.98 36.67,143.99 38.45,145.76 R19.2 38.55,147.48 40.8,147.48 42.36,145.92 R12.2 46.83,145.95 46.83,148.27 48.6,150.05 48.6,150.68 | R20.2 48.6,150.68 | R13.2 56.99,145.46 56.99,147.96 58.86,149.83 R21.2 58.9,151.22 58.9,151.92 | R14.2 67.15,141.89 67.15,143.83 68.75,145.42 R22.2 68.75,148.9 | R23.2 78.9,143.51 78.9,141.92 78.74,141.76 | R15.2 77.31,140.34 78.74,141.76 | R24.2 92.96,132.81 92.87,132.72 | R16.2 91.28,129.29 91.28,131.13 92.87,132.72 | 48.6,150.68 48.89,150.97 52.7,150.97 54.45,152.72 58.1,152.72 58.9,151.92 | 68.75,148.9 67.94,149.7 61.12,149.7 58.9,151.92 | 78.74,141.76 78.74,145.1 | 78.74,145.1 77.95,145.89 73.03,145.89 71.75,145.89 68.75,148.9 | 92.87,132.72 92.87,136.21 92.07,137 86.84,137 78.74,145.1 | R3.2 34.66,42.02 | 33.66,43.02 33.34,43.34 | C4.1 30.96,31.05 | 30.96,31.05 31.11,31.21 | 30.48,30.96 30.86,30.96 30.96,31.05
  Top 0.813: 34.66,42.02 33.66,43.02 v34.92,44.29 | 33.34,43.34 30.64,43.34 29.69,42.39 29.69,31.75 30.48,30.96 29.92,30.4 | v42.55,6.19 40.96,4.6 34.61,4.6 29.69,9.53 29.69,30.16 29.92,30.4 | 34.92,31.21 31.11,31.21 30.73,31.21 | R17.2 11.1,129.08 v10.8,129.38 | +5V.1 28.73,31.59 29.92,30.4
  Bottom 0.305: DRIVER.20 53.68,15.06 | 53.98,14.76 54.77,14.76
  Bottom 0.406: REG.4 43.81,15.4 43.97,15.4 | 43.97,15.4 44.77,14.61 49.69,14.61 50.48,15.4 | 50.48,15.4 50.48,18.05 DRIVER.15 | DRIVER.23 55.63,15.47 54.77,14.76 | 50.48,15.4 50.48,15.24 51.28,14.76 52.7,14.76 | 52.7,14.76 53.98,14.76 53.68,15.06 | DRIVER.19 53.03,14.77 52.7,14.76 | 42.23,9.05 42.62,8.65 | 43.97,15.4 44.08,15.4 44.08,15.37
  Bottom 0.61: REG.4 42.55,15.4 43.34,14.61 43.34,12.07 42.23,10.95 C5.1
  Bottom 0.813: 43.81,14.45 44.08,15.37 44.13,15.56 | v10.8,129.38 10.8,128.11 13.34,125.57 18.41,125.57 27.3,134.46 37.46,134.46 43.81,128.11 43.81,117.95 47.62,114.14 47.62,55.72 40.64,48.74 40.64,47.47 38.58,45.4 38.58,44.64 SJ1.2
  Bottom 1.016: REG.2 42.55,15.4 | SJ1.2 35.24,44.61 v34.92,44.29
  Bottom 1.27: v42.55,6.19 42.55,8.57 42.62,8.65 43.34,9.37 43.34,14.93 43.81,15.4
COLECTOR_EMISORES  (via drill 0.6)  (1 unrouted)
  Top 0.61: Q1.3 16.77,126.47
  Top 1.27: 16.77,126.47 17.09,126.47 v18.41,127.79
  Bottom 0.406: 39.37,145.42 39.53,145.42 QRE3.2
  Bottom 0.61: 29.49,141.61 QRE2.2 | QRE2.2 29.65,141.45 35.4,141.45 39.37,145.42 45.88,145.42 QRE4.2 53.14,145.89 56.52,145.89 QRE5.2 62.01,149.28 62.86,148.43 62.86,144.62 65.41,142.08 66.68,142.08 QRE6.2 72.17,145.47 73.03,144.62 73.03,140.81 75.56,138.27 76.84,138.27 QRE7.2 81.06,141.66 87,135.73 87,131.92 89.53,129.38 90.81,129.38 QRE8.2 | QR1.2 15.88,133.19 | 15.88,133.19 20.95,138.27 26.04,138.27 QRE2.2 | v18.41,127.79 18.41,130.65 15.88,133.19
D+  (via drill 0.6)
  Top 0.406: 49.42,42.82 UC.4 48.26,44.03 48.26,46.51 v47.15,47.63
  Bottom 0.406: R1.2 53.61,43.93 52.7,43.02 49.37,43.02 48.26,44.13 48.26,46.51 v47.15,47.63
D-  (via drill 0.6)
  Top 0.406: UC.3 49.05,44.37 v49.05,47.63
  Bottom 0.406: R2.2 50.64,45.09 50.16,45.56 50.16,46.36 v49.05,47.63
GND  (via drill 0.6)
  Top 0.356: C19.2 C18.2
  Top 0.406: 48.87,42.25 UC.5 47.62,43.53 47.59,43.53 47.31,43.82 47.31,45.75 C10.2 47.23,45.8 45.56,47.47 45.56,47.63 | 58.81,39.44 UC.35 58.12,38.74 58.1,38.74 | 58.81,39.44 59.69,40.32 60.64,40.32 60.96,40.01 | C1.1 39.85,26.38 C2.1 39.67,27.78 38.73,27.78 37.46,26.51 | 36.98,26.03 37.46,26.51 | 50.96,3.01 50.96,2.86 | 37.46,26.51 37.46,29.05 39.37,30.96 40.8,30.96 41.43,31.59 44.13,31.59 47.16,34.61 UC.15 47.21,34.67 48.1,35.56 48.81,35.56 UC.23 53.71,30.58 52.65,30.58 51.43,29.37 51.43,27.15 52.23,26.35 53.82,26.35 54.13,26.67 | 58.1,38.74 56.83,38.74 53.34,42.23 53.34,43.02 54.27,43.95 UC.43 54.43,43.95 54.43,44.11 55.09,44.77 55.09,45.4 54.61,45.88 52.39,45.88 51.91,46.36 51.91,47.35 C9.2 51.91,47.47 | 58.1,38.74 58.81,39.44 | UC.33 59.41,36.31 60.32,35.4 60.96,36.04 60.96,40.01 | C12.2 15.45,137.69 16.35,138.59 C13.2 17.67,139.28 19.05,140.65 24.38,140.65 QRE2.4 | C16.2 54.61,27.15 54.13,26.67 | R8.1 55.19,23.65 55.09,23.65 54.45,23.65 54.13,23.97 54.13,26.67 | 60.96,40.01 61.44,40.01 v61.59,40.16 | 59.37,2.38 58.58,1.59 | D6.1 73.66,38.1 76.04,35.72 76.04,30.06 C17.2 68.74,28.1 65.09,24.45 65.09,19.84 62.86,17.62 58.9,17.62 | R26.2 9.68,127.32 9.21,126.84
  Top 0.61: LED1.C 50.56,5 51.43,4.13 | 50.96,3.01 BLUETOOTH.GND | 51.43,4.13 BLUETOOTH.GND 51.43,1.59 51.91,1.11 58.1,1.11 58.58,1.59 58.9,1.91 58.9,17.62 58.9,19.05 55.24,22.7 55.24,23.5 55.09,23.65 | 40,8.73 50.16,8.73 51.43,7.46 51.43,4.13 | Q1.2 10.37,125.52 9.21,126.68 9.21,126.84 9.21,130.49 9.68,130.97 11.19,130.97 QR1.4 | 40,8.73 36.19,12.54 36.19,25.14 35.75,25.59 | 35.75,25.59 C8.- | v40,6.19 40,8.73 | 32.06,34.14 v33.34,33.18 35.51,35.51 JP1.6 | C4.2 30.96,26.99 32.38,25.56 35.72,25.56 35.75,25.59 | 45.56,47.63 v44.13,47.63
  Top 0.813: 50.96,2.86 51.43,2.38 BLUETOOTH.GND
  Top 1.27: C8.- 36.98,26.03
  Bottom 0.356: DRIVER.18 52.38,28.09 58.1,33.81 68.37,33.81 C17.2
  Bottom 0.406: DRIVER.10 50.64,11 50.64,11.27 51.08,10.83 DRIVER.9 | DRIVER.4 54.61,11.07 54.61,11.27 54.98,10.9 DRIVER.3 | C7.2 C6.2 31.7,17.04 33.02,15.72 33.66,15.08 | 53.96,48.84 arc-90 54.99,47.33 54.99,44.71 59.53,40.16 v61.59,40.16 61.59,17.51 65.88,13.23 | 39.26,10.32 C5.2 | C3.C 37.27,20.35 | C17.2 74.08,25.45 JP2.1 | LED4.K 41.27,135.73 43.81,133.19 50.16,133.19
  Bottom 0.61: 33.38,15.45 STEP.GND_OUT | QR1.4 11.2,131.05 19.68,139.54 24.84,139.54 QRE2.4 25.16,139.94 28.57,143.35 28.73,143.35 29.05,143.67 35.32,143.67 QRE3.4 35.73,143.68 39.53,147.48 45.48,147.48 QRE4.4 45.48,147.56 45.96,147.56 49.37,150.97 50.96,150.97 54.29,147.64 55.49,147.64 QRE5.4 56.05,147.49 59.21,150.65 62.71,150.65 64.29,149.07 64.29,145.19 QRE6.4 | 65.8,143.67 QRE6.4 | 75.96,139.86 QRE7.4 | QRE6.4 66.05,143.68 69.53,147.16 73.03,147.16 74.3,145.89 74.3,141.54 QRE7.4 | QRE7.4 75.97,139.94 79.38,143.35 81.91,143.35 88.27,137 88.27,132.65 QRE8.4 | STEP.GND_OUT_1 33.66,12.54 | C5.2 38.73,10.95 | 38.73,10.95 36.51,10.95 33.66,13.81 | 37.27,20.35 34.92,22.7 | 34.92,22.7 29.84,22.7 28.26,21.11 28.26,16.83 29.37,15.72 33.02,15.72 | 34.92,22.7 35.08,22.7 35.4,23.02 | 34.92,22.7 35.4,23.18 35.4,32.23 34.45,33.18 v33.34,33.18 32.86,33.34 32.86,40.01 34.61,41.75 41.27,41.75 43.54,44.02 C11.2 43.54,47.03 v44.13,47.63 | v40,6.19 40,9.68 38.73,10.95
  Bottom 0.813: 36.92,13.19 REG.1 | STEP.GND_OUT 33.66,15.08 33.66,13.81 STEP.GND_OUT_1 | STEP.GND_VIN_1 71.75,8.73 STEP.GND_VIN | 50.27,13.23 50.64,12.86 50.64,11.27 | 54.08,13.23 54.37,12.94 | 54.37,12.94 54.61,12.7 54.61,11.27 | 54.37,13.23 54.37,12.94 | 67.94,12.54 68.58,11.91 | 88.27,132.65 88.27,134.46 89.53,135.73 93.19,135.73 95.57,133.35 95.57,127.32 94.61,126.37 86.04,126.37 76.99,135.41 68.9,135.41 61.59,128.11 61.59,117.95 57.78,114.14 57.78,43.97 v61.59,40.16
  Bottom 1.016: STEP.GND_OUT_1 36.92,13.19
  Bottom 1.27: 50.27,13.23 54.08,13.23 | 54.37,13.23 65.88,13.23 67.26,13.23 68.58,11.91 70.48,10 71.1,10 STEP.GND_VIN 71.61,10.8 71.28,10.8 72.07,10 73.5,10 73.75,10.26
  Bottom 1.422: JP2.1 74.23,11.21 71.75,8.73
  pour Bottom (isolate 0.406): 78.1,-0.16 26.03,-0.16 26.03,54.45 78.1,54.45
  pour Bottom (isolate 0.406): 98.42,54.45 6.98,54.45 6.98,153.51 97.16,153.51
  pour Top (isolate 0.406): 97.16,54.45 6.98,54.45 6.98,153.51 97.16,152.24
  pour Top (isolate 0.406): 27.3,46.83 79.38,46.83 78.1,1.11 26.03,1.11
M1
  Bottom 0.305: DRIVER.2 DRIVER.1 | M2.M1 79.56,17.71 C14.2
  Bottom 0.813: DRIVER.1 56.04,10.55 56.04,9.21 59.05,6.19 59.21,6.19 60.8,4.6 72.39,4.6 77.47,9.68 77.47,15.72 79.38,17.62 79.38,18.56 M2.M1
M2
  Bottom 0.305: DRIVER.5 53.68,10.18 | 79.85,10.62 79.85,11.8 C14.1
  Bottom 0.406: DRIVER.6 DRIVER.5 53.65,10.79 53.34,10.48 53.34,9.84
  Bottom 0.813: 79.85,10.62 M2.M2 | 79.38,8.73 79.38,10.25 M2.M2 | 53.34,9.84 53.34,9.05 59.21,3.18 73.5,3.18 80.01,9.68 80.01,10.14 M2.M2
M3
  Bottom 0.305: 52.07,10.32 52.07,10.48 DRIVER.7 DRIVER.8
  Bottom 0.406: 26.83,9.05 26.19,9.05 23.18,12.07 C15.1
  Bottom 0.813: 52.07,10.32 52.07,7.94 49.05,4.92 47.62,4.92 46.35,3.18 32.86,3.18 26.03,10 25.88,10 M1.M1 26.83,9.05
M4
  Bottom 0.305: DRIVER.11 DRIVER.12
  Bottom 0.406: C15.2 23.18,16.99 24.61,18.42 M1.M2
  Bottom 0.813: DRIVER.12 49.37,10.55 49.37,9.53 44.77,4.6 33.97,4.6 28.57,10 28.57,11.27 26.03,13.81 26.03,17.99 M1.M2 25.72,18.31
MISO
  Top 0.406: UC.11 45.51,38.89 44.7,39.7 42,39.7 JP1.1
MOSI  (via drill 0.6)
  Top 0.305: v42.35,36.86 38.89,36.83
  Top 0.406: JP1.4 37.89,35.83 38.89,36.83 | UC.10 45.98,39.42 44.7,40.7 42.96,40.7 v42.38,40.73
  Bottom 0.406: 42.38,36.88 v42.35,36.86
  Bottom 0.61: v42.38,40.73 42.38,36.88
N$1
  Top 0.406: UC.17 48.25,33.48 43.81,29.05 43.81,26.51 42.55,25.24 42.17,25.24 Y1.2
  Top 0.61: C1.2 39.87,24.1 40,23.97 40.9,23.97 Y1.2
N$2
  Top 0.406: UC.16 43.72,29.99 Y1.1 40.08,29.99 C2.2
N$3
  Top 0.406: R26.1 12.81,127.42 Q1.1 14.42,127.32 14.92,127.32 16.99,129.38 R9.1
N$4
  Top 0.61: LED1.A 44.27,5 R4.1
N$5
  Top 0.406: LED2.C 50.8,24.77 50.32,25.24 50.32,26.01 R5.2
N$6
  Top 0.406: R6.2 41.8,43.02 41.43,43.02 41.12,43.34 41.12,48.26 41.59,48.74 44.61,48.74 45.72,49.85 45.72,52.03 LED3.C
N$7
  Bottom 0.406: 52.01,48.84 52.01,47.07 R2.1
N$8
  Bottom 0.406: 52.66,48.84 52.66,47.84 R1.1
N$9
  Top 0.406: UC.42 54.86,43.38 54.86,43.43 55.72,44.29 55.72,46.67 54.93,47.47 53.71,47.47 C9.1
N$10
  Top 0.406: LED6.C R27.2 73.45,44.29
N$17
  Top 0.61: R18.1 26.25,143.57 25.08,142.4 25.08,141.76 QRE2.1
N$18
  Top 0.61: R19.1 36.25,147.38 35.4,146.53 35.4,145.62 QRE3.1
N$19
  Top 0.61: R20.1 46.15,151.24 45.4,150.5 45.4,149.38 QRE4.1
N$20
  Top 0.61: R21.1 56.26,151.19 55.56,150.5 55.56,149.38 QRE5.1
N$21
  Top 0.61: QRE6.1 65.78,147.06 66.04,147.32 66.93,147.32 R22.1
N$22
  Top 0.61: QRE7.1 75.94,143.25 76.2,143.51 77.08,143.51 R23.1
N$23
  Top 0.61: R24.1 90.2,134.81 89.85,134.46 89.85,132.87 QRE8.1
N$24
  Top 0.61: R25.1 12.21,134.92 11.27,133.99 11.27,132.92 QR1.1
PB4
  Top 0.356: 56.52,33.5 59.69,30.32 69.22,30.32
  Top 0.406: 56.54,33.47 UC.28 56.53,33.5 56.52,33.5 | 70.35,34.13 B4.2 70.48,31.59 69.22,30.32
PB5  (via drill 0.6)
  Top 0.406: UC.29 57.11,34.01 v58.9,32.23
  Bottom 0.406: DRIVER.21 54.33,28.1 58.3,32.07 58.9,32.07 | 59.05,32.07 58.9,32.07 | 58.9,32.07 v58.9,32.23
PB6  (via drill 0.6)
  Top 0.406: UC.30 57.78,34.61 v60.32,32.07
  Bottom 0.406: v60.32,32.07 60.32,31.59 54.98,26.25 DRIVER.22
PB7  (via drill 0.6)
  Top 0.406: UC.12 44.65,36.31 v44.13,36.83
  Bottom 0.406: v44.13,36.83 44.13,31.27 46.35,29.05 46.35,23.97 51.08,19.25 DRIVER.16
PC6
  Top 0.406: R16.1 92.96,127.73 92.07,126.84 85.57,126.84 78.58,133.83 68.58,133.83 60.64,125.89 60.64,117 56.52,112.87 56.52,55.72 64.13,48.1 64.13,34.93 62.55,33.34 60.01,33.34 58.32,35.02 58.32,35.18 UC.31
  Top 0.61: R16.1 93.92,129.16 94.3,129.54 94.3,130.84 QRE8.3
PC7
  Top 0.406: R15.1 79.12,136.11 77.63,134.62 68.1,134.62 59.69,126.21 59.69,117.48 55.56,113.35 55.56,55.4 62.86,48.1 62.86,35.4 62.07,34.61 59.94,34.61 UC.32
  Top 0.61: QRE7.3 80.25,138.35 80.01,138.11 79.18,138.11 R15.1
PD0  (via drill 0.6)
  Top 0.406: v46.35,30.32 47.62,31.64 UC.18
  Bottom 0.406: DRIVER.17 51.73,19.87 47.15,24.45 47.15,29.53 v46.35,30.32
PD1
  Top 0.406: UC.19 49.34,32.35 47.78,30.8 47.78,24.92 45.88,23.02 D1.1
PD4
  Top 0.406: UC.25 54.89,31.79 57.15,29.53 57.15,27.2 C16.1 57.1,25.56 R7.1 R8.2
PD6
  Top 0.406: UC.26 55.44,32.35 58.74,29.05 71.12,29.05 73.66,31.59 D6.2
PD7
  Top 0.406: LED6.A 67.47,38.42 69.22,36.67 71.75,36.67 73.03,35.4 73.03,32.86 70.88,30.72 70.48,30.32 69.85,29.69 59.21,29.69 58.58,30.32 58.57,30.32 UC.27
PE6
  Top 0.406: UC.1 50.16,45.52 50.16,52.23 49.05,53.34 49.05,113.03 43.18,118.9 43.18,127.32 36.51,134.14 28.26,134.14 23.97,129.86 R9.2
PF0
  Top 0.406: 55.52,42.82 UC.41 56.67,44.08 56.67,46.99 55.09,48.58 52.7,48.58 51.43,49.85 51.43,52.07 50.01,53.5 50.01,113.19 43.97,119.22 43.97,127.95 36.83,135.1 28.1,135.1 24.13,131.13 15.56,131.13 15.4,130.97 15.4,129.54 14.94,129.08 14.78,129.08
  Top 0.61: R17.1 14.78,129.08 15.4,129.7 15.4,130.85 QR1.3
PF1
  Top 0.406: QRE2.3 29.53,139.73 29.53,138.59 28.99,138.05 R10.1 28.79,138.05 30.96,135.89 37.31,135.89 44.93,128.27 44.93,119.38 50.96,113.35 50.96,53.66 52.39,52.23 52.39,50.32 53.34,49.37 55.4,49.37 57.78,46.99 57.78,44.06 UC.40
PF4
  Top 0.406: 38.83,141.86 38.83,135.79 45.88,128.75 45.88,119.7 51.91,113.67 51.91,53.98 58.58,47.31 58.58,43.72 UC.39
  Top 0.61: R11.1 38.83,141.86 39.69,142.72 39.69,143.54 QRE3.3
PF5
  Top 0.406: 49.4,145.92 49.4,131.16 46.83,128.59 46.83,120.02 46.99,120.02 53.02,113.98 53.02,53.98 59.37,47.63 59.37,43.38 UC.38
  Top 0.61: R12.1 49.4,145.92 49.85,146.37 49.85,147.35 QRE4.3
PF6
  Top 0.356: 58.89,145.1 59.84,145.1 62.86,142.08 62.86,131.76
  Top 0.406: UC.37 57.7,40.55 60.32,43.18 60.32,48.26 53.98,54.61 53.98,114.14 57.63,117.79 57.63,126.68 62.71,131.76 62.86,131.76 | R13.1 58.89,145.1
  Top 0.61: R13.1 59.47,145.36 59.85,145.73 59.85,147.36 QRE5.3
PF7
  Top 0.406: R14.1 68.92,136.55 58.74,126.37 58.74,117.63 54.77,113.67 54.77,54.93 61.12,48.58 61.12,42.7 58.4,39.99 UC.36
  Top 0.61: R14.1 69.63,141.86 70.17,142.4 70.17,143.54 QRE6.3
RST  (via drill 0.6)
  Top 0.305: 36.63,36.85 36.63,34.75
  Top 0.406: RST.2 31.65,39.31 32.86,38.1 35.32,38.1 JP1.5 35.37,38.13 36.63,36.85 | 36.63,34.75 37.7,33.7 v39.7,33.7 | v42.45,34.65 45.03,34.7 UC.13
  Top 0.61: JP1.5 35.35,40.17 R3.1
  Bottom 0.61: v39.7,33.7 41.7,33.7 v42.45,34.65
RX
  Top 0.406: UC.20 48.42,30.16 48.42,24.45 53.98,18.89 BLUETOOTH.TX
RXLED
  Top 0.406: R6.1 44.79,42.98 UC.8
SCK
  Top 0.406: JP1.3 37.89,38.89 40.7,41.7 44.93,41.7 UC.9
TX
  Top 0.406: UC.21 50.59,31.22 49.21,29.85 49.21,24.92 56.52,17.62 BLUETOOTH.RX
TXLED
  Top 0.406: UC.22 50.65,30.13 50.61,30.13 50.32,29.85 50.32,27.82 R5.1
UCAP
  Top 0.406: UC.6 48.33,41.69 45.56,44.45 45.56,45.69 C10.1
VCC
  Bottom 0.305: 48.92,18.31 48.79,18.44
  Bottom 0.406: 33.6,18.84 C6.1 C7.1 | DRIVER.14 DRIVER.13 | 48.79,18.44 48.07,18.44
  Bottom 0.61: 33.64,18.26 STEP.VOUT 33.66,17.62 | C3.A 44.45,20.35 46.35,18.44
  Bottom 0.813: 33.6,18.84 33.66,18.89
  Bottom 1.016: STEP.VOUT_4 33.66,18.89 STEP.VOUT 36.44,18.27 | REG.3 37.02,18.44 46.35,18.44 48.79,18.44
  Bottom 1.27: 48.92,18.31 DRIVER.13
  Bottom 1.422: 36.44,18.27 REG.3

### Text on the board
tNames: 4 | 5 | F5 | F6 | 3 | 6 | F4 | 2 | F7 | 7 | F1 | C7 | 1 | F0 | 8 | C6 | E6 | Line Follower / Natsuky | RX | D7 | POWERED BY: / MICHAEL VARGAS | + | - | TX | MADE IN / COLOMBIA | 19/01/2016 / V1.0